# EAGLE design cn2-interceptor (EAGLE 9.6.2)
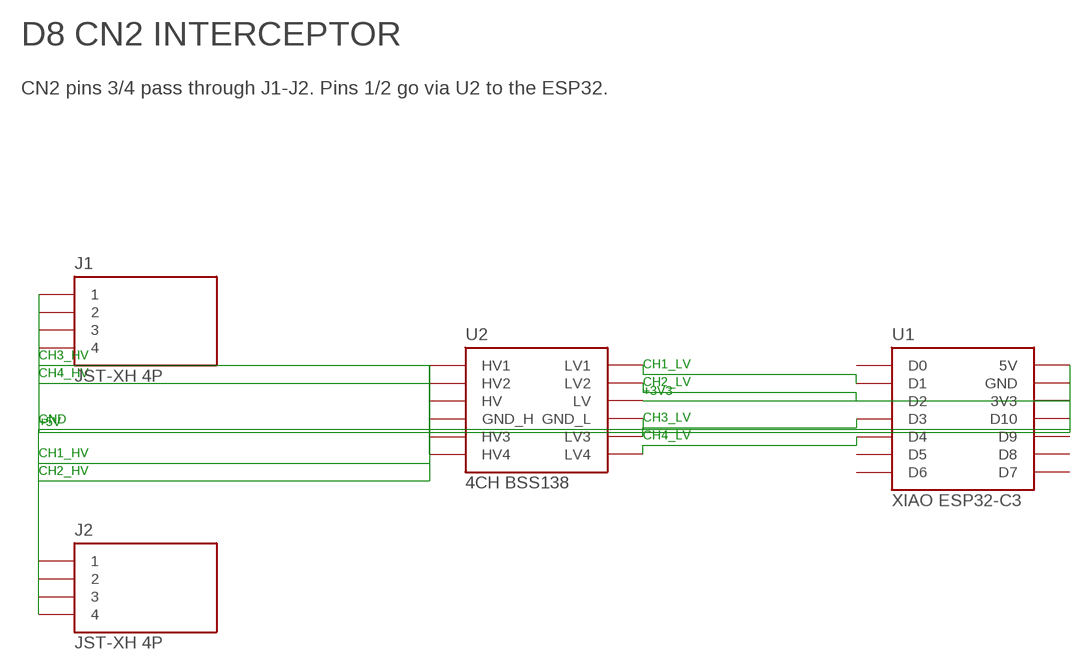
[diagram p0: schematic, sheet 1]

## Parts
J1  JST-XH 4P  CONN_4  [JST_XH_4]
J2  JST-XH 4P  CONN_4  [JST_XH_4]
U1  XIAO ESP32-C3  XIAO_ESP32C3  [XIAO_2X7]
U2  4CH BSS138  LEVELSHIFT  [LS_2X6]

## Nets
+3V3: U1.3V3 U2.LV
+5V: J1.4 J2.4 U1.5V U2.HV
CH1_HV: J2.1 U2.HV1
CH1_LV: U1.D1 U2.LV1
CH2_HV: J2.2 U2.HV2
CH2_LV: U1.D2 U2.LV2
CH3_HV: J1.1 U2.HV3
CH3_LV: U1.D3 U2.LV3
CH4_HV: J1.2 U2.HV4
CH4_LV: U1.D4 U2.LV4
GND: J1.3 J2.3 U1.GND U2.GND_H U2.GND_L
Unconnected: U1.D0 U1.D5 U1.D6 U1.D7 U1.D8 U1.D9 U1.D10

## Notes on the sheet
- D8 CN2 INTERCEPTOR
- CN2 pins 3/4 pass through J1-J2. Pins 1/2 go via U2 to the ESP32.

## Library data of the parts
J1 J2 = cn2interceptor:CONN_4
U1 = cn2interceptor:XIAO_ESP32C3
U2 = cn2interceptor:LEVELSHIFT

## Board
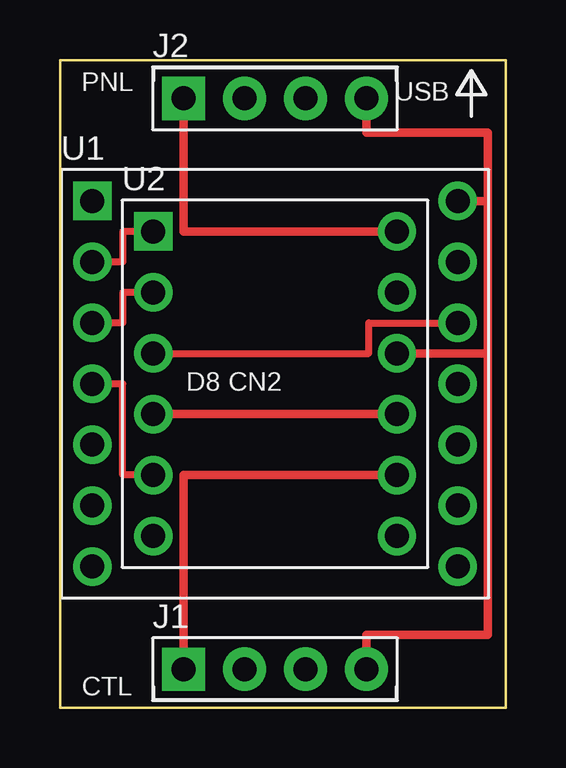
[diagram p1: board, top side]
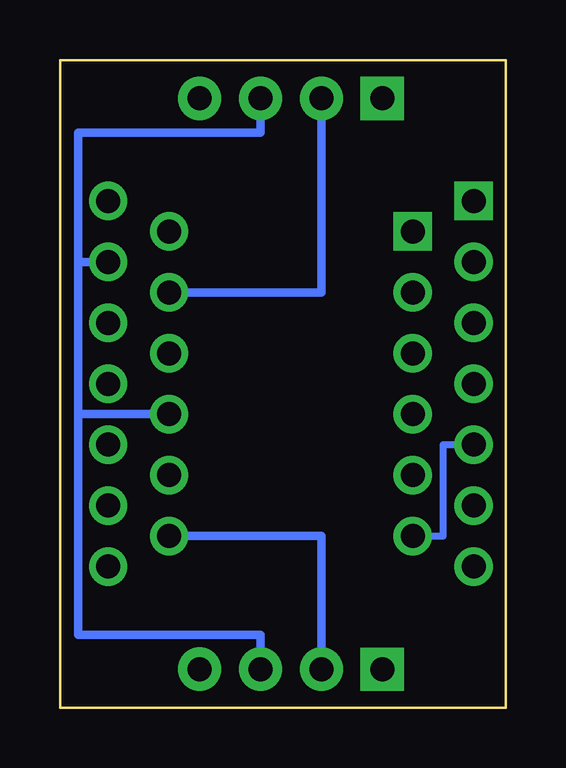
[diagram p2: board, bottom side, seen from below]

Size 18.6 x 27 mm. Coordinates in mm from the lower left corner, seen from the top.
Outline: 0,27 18.6,27 18.6,0 0,0 0,27
Copper layers used: Top, Bottom
Design rules "cn2": minimum track width 0.2mm, minimum drill 0.3mm, track to track 0.2mm, track to pad 0.2mm, pad to pad 0.2mm, minimum pad ring 0.3mm

### Footprints (pad centres in the part's own frame; a part is rotated, then mirrored left to right if it is on the bottom)
JST_XH_4 = drill 1 pad 1.8 square: 1 0,0 | drill 1 pad 1.8 round: 2 2.54,0; 3 5.08,0; 4 7.62,0
XIAO_2X7 = drill 1 pad 1.6 round: 3V3 15.24,-5.08; 5V 15.24,0; D1 0,-2.54; D2 0,-5.08; D3 0,-7.62; D4 0,-10.16; D5 0,-12.7; D6 0,-15.24; D7 15.24,-15.24; D8 15.24,-12.7; D9 15.24,-10.16; D10 15.24,-7.62; GND 15.24,-2.54 | drill 1 pad 1.6 square: D0 0,0
LS_2X6 = drill 1 pad 1.6 round: GND_H 10.16,-7.62; GND_L 0,-7.62; HV 10.16,-5.08; HV1 10.16,0; HV2 10.16,-2.54; HV3 10.16,-10.16; HV4 10.16,-12.7; LV 0,-5.08; LV2 0,-2.54; LV3 0,-10.16; LV4 0,-12.7 | drill 1 pad 1.6 square: LV1 0,0

### Placement (x,y rotation side)
J1  5.16,1.6 0 top
J2  5.16,25.4 0 top
U1  1.35,21.12 0 top
U2  3.89,19.85 0 top

### Tracks (layer width: path | path; a pad name or v marks a point on that pad's centre or on a via)
+3V3
  Top 0.3: U2.LV 12.88,14.77 12.88,16.04 U1.3V3
+5V
  Top 0.35: J2.4 12.78,23.96 17.85,23.96 17.85,21.12 | 17.85,21.12 U1.5V | 17.85,21.12 17.85,14.77 | 17.85,14.77 U2.HV | J1.4 12.78,3.04 17.85,3.04 17.85,14.77
CH1_HV
  Top 0.35: J2.1 5.16,19.85 U2.HV1
CH1_LV
  Top 0.3: U2.LV1 2.62,19.85 2.62,18.58 U1.D1
CH2_HV
  Bottom 0.35: J2.2 7.7,17.31 U2.HV2
CH2_LV
  Top 0.3: U2.LV2 2.62,17.31 2.62,16.04 U1.D2
CH3_HV
  Top 0.35: J1.1 5.16,9.69 U2.HV3
CH3_LV
  Top 0.3: U2.LV3 2.62,9.69 2.62,13.5 U1.D3
CH4_HV
  Bottom 0.35: J1.2 7.7,7.15 U2.HV4
CH4_LV
  Bottom 0.3: U2.LV4 2.62,7.15 2.62,10.96 U1.D4
GND
  Top 0.35: U2.GND_H U2.GND_L
  Bottom 0.35: J2.3 10.24,23.96 17.85,23.96 17.85,18.58 | 17.85,18.58 U1.GND | 17.85,18.58 17.85,12.23 | 17.85,12.23 U2.GND_H | J1.3 10.24,3.04 17.85,3.04 17.85,12.23

### Text on the board
tPlace: PNL | USB | D8 CN2 | CTL